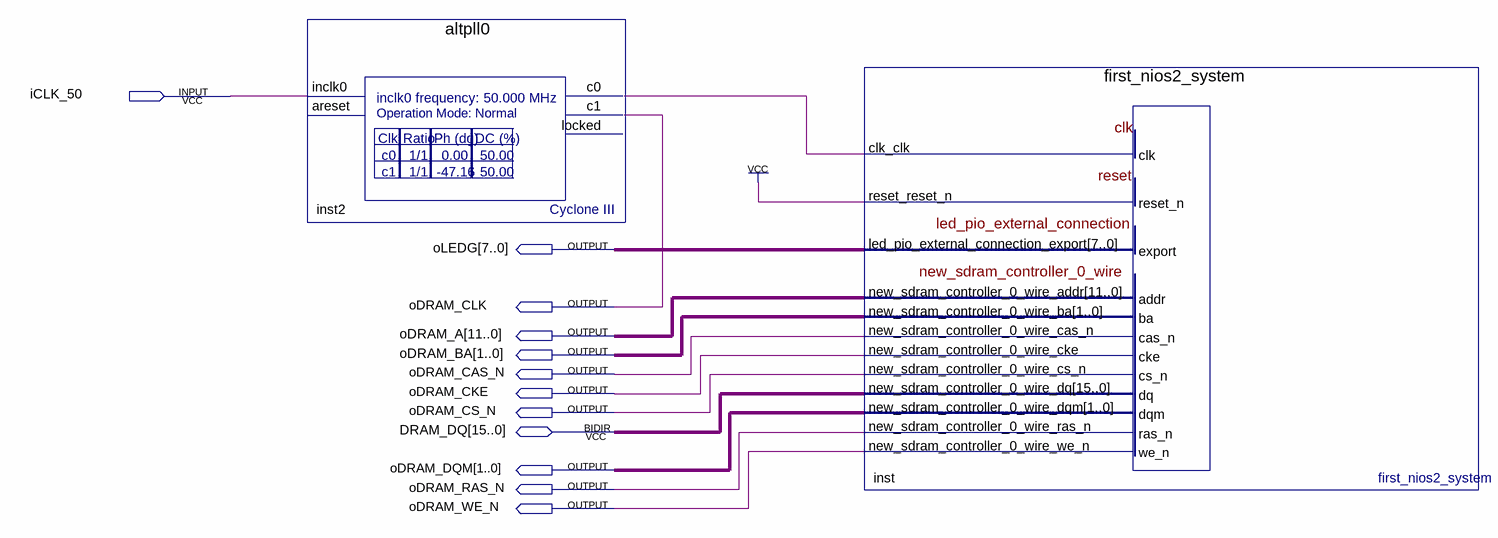
[diagram p0: schematic sheet]
// Quartus schematic hello_world.bdf as structural Verilog: 2 symbols, 12 pins
module hello_world (
  input  iCLK_50,
  inout  [15:0] DRAM_DQ,
  output [7:0] oLEDG,
  output oDRAM_CLK,
  output [11:0] oDRAM_A,
  output [1:0] oDRAM_BA,
  output oDRAM_CAS_N,
  output oDRAM_CKE,
  output oDRAM_CS_N,
  output [1:0] oDRAM_DQM,
  output oDRAM_RAS_N,
  output oDRAM_WE_N
);

  wire inst2_c0;

  altpll0 inst2 (.inclk0(iCLK_50), .c0(inst2_c0), .c1(oDRAM_CLK));  // open: areset, locked
  first_nios2_system inst (
    .clk_clk(inst2_c0), .reset_reset_n(1'b1), .led_pio_external_connection_export(oLEDG),
    .new_sdram_controller_0_wire_addr(oDRAM_A), .new_sdram_controller_0_wire_ba(oDRAM_BA),
    .new_sdram_controller_0_wire_cas_n(oDRAM_CAS_N), .new_sdram_controller_0_wire_cke(oDRAM_CKE),
    .new_sdram_controller_0_wire_cs_n(oDRAM_CS_N), .new_sdram_controller_0_wire_dqm(oDRAM_DQM),
    .new_sdram_controller_0_wire_ras_n(oDRAM_RAS_N), .new_sdram_controller_0_wire_we_n(oDRAM_WE_N),
    .new_sdram_controller_0_wire_dq(DRAM_DQ));
endmodule
